# Altium schematic sheet ESP32.SchDoc
size A; SheetNumber: 2; SheetTotal: 6
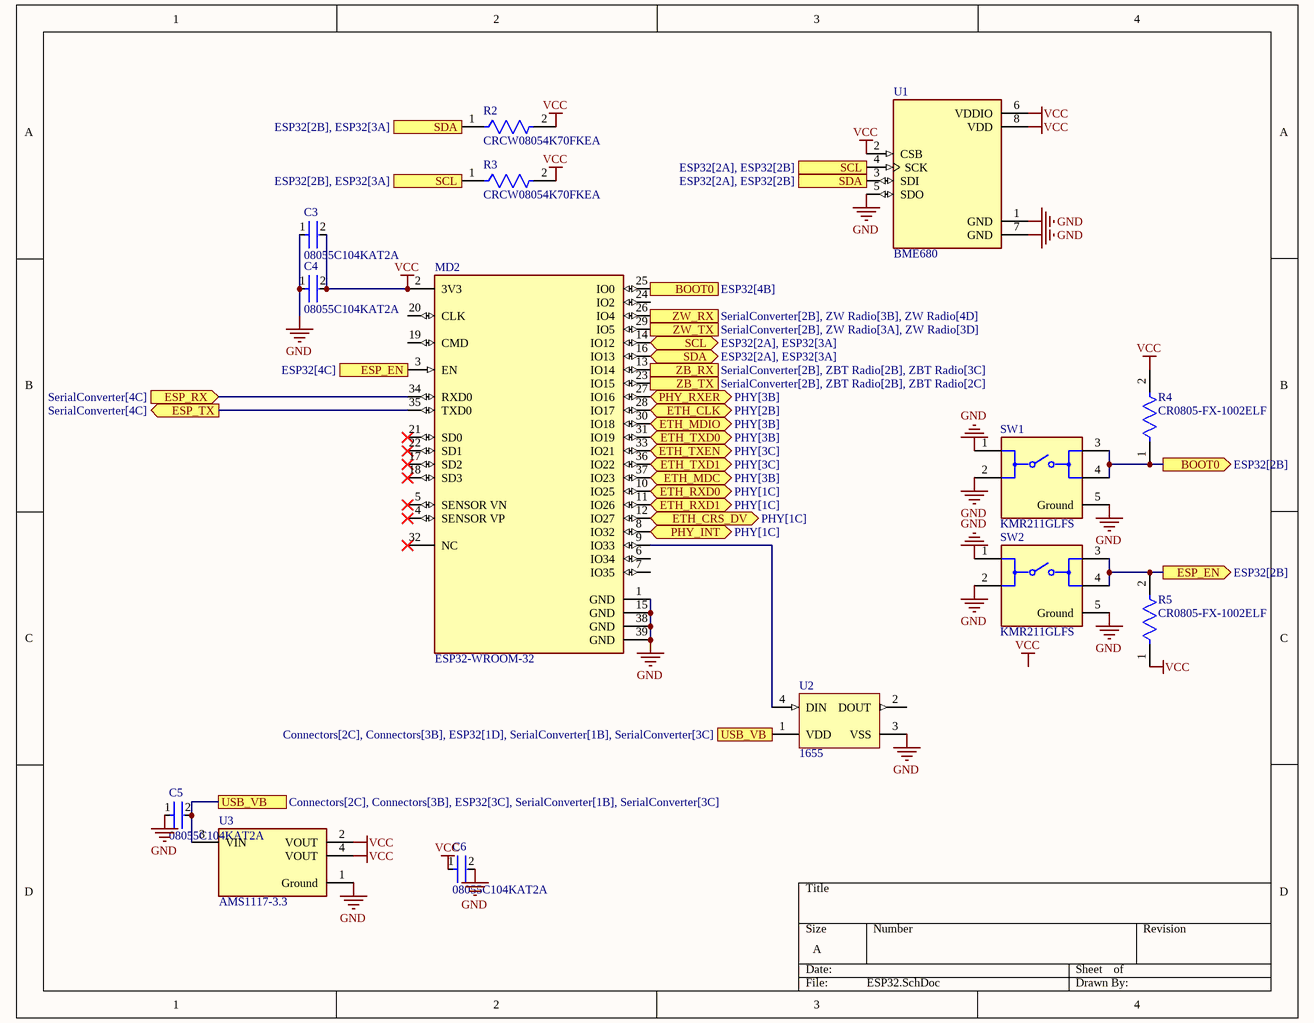
[diagram p0: ESP32.SchDoc]

## Parts
C3  08055C104KAT2A  [FP-0805-L_2_01_0_2-W_1_25-IPC_C]
C4  08055C104KAT2A  [FP-0805-L_2_01_0_2-W_1_25-IPC_C]
C5  08055C104KAT2A  [FP-0805-L_2_01_0_2-W_1_25-IPC_C]
C6  08055C104KAT2A  [FP-0805-L_2_01_0_2-W_1_25-IPC_C]
MD2  ESP32-WROOM-32  [FP-ESP32-WROOM-32-MFG]
R2  CRCW08054K70FKEA  [FP-CRCW0805-e3-IPC_B]
R3  CRCW08054K70FKEA  [FP-CRCW0805-e3-IPC_B]
R4  CR0805-FX-1002ELF  [FP-CR0805-IPC_A]
R5  CR0805-FX-1002ELF  [FP-CR0805-IPC_A]
SW1  KMR211GLFS  [FP-KMR211GLFS-MFG]
SW2  KMR211GLFS  [FP-KMR211GLFS-MFG]
U1  BME680  [PSON80P300X300X100-8N]
U2  1655  [ADA-RGB-1655_V]
U3  AMS1117-3.3  [FP-AMS1117-IPC_C]

## Ports
BOOT0 (in, see ESP32[4B]), BOOT0 (out, see ESP32[2B]), ESP_EN (in, see ESP32[4C]), ESP_EN (out, see ESP32[2B]), ESP_RX (in, see SerialConverter[4C]), ESP_TX (out, see SerialConverter[4C]), ETH_CLK (bidir, see PHY[2B]), ETH_CRS_DV (bidir, see PHY[1C]), ETH_MDC (bidir, see PHY[3B]), ETH_MDIO (bidir, see PHY[3B]), ETH_RXD0 (bidir, see PHY[1C]), ETH_RXD1 (bidir, see PHY[1C]), ETH_TXD0 (bidir, see PHY[3B]), ETH_TXD1 (bidir, see PHY[3C]), ETH_TXEN (bidir, see PHY[3C]), PHY_INT (bidir, see PHY[1C]), PHY_RXER (bidir, see PHY[3B]), SCL (bidir, see ESP32[2A], ESP32[3A]), SCL (see ESP32[2A], ESP32[2B]), SCL (see ESP32[2B], ESP32[3A]), SDA (bidir, see ESP32[2A], ESP32[3A]), SDA (see ESP32[2A], ESP32[2B]), SDA (see ESP32[2B], ESP32[3A]), USB_VB (see Connectors[2C], Connectors[3B], ESP32[1D], SerialConverter[1B], SerialConverter[3C]), USB_VB (see Connectors[2C], Connectors[3B], ESP32[3C], SerialConverter[1B], SerialConverter[3C]), ZB_RX (out, see SerialConverter[2B], ZBT Radio[2B], ZBT Radio[3C]), ZB_TX (in, see SerialConverter[2B], ZBT Radio[2B], ZBT Radio[2C]), ZW_RX (out, see SerialConverter[2B], ZW Radio[3B], ZW Radio[4D]), ZW_TX (in, see SerialConverter[2B], ZW Radio[3A], ZW Radio[3D])

## Nets
GND: C3.1 C4.1 C5.1 C6.2 MD2.1(GND) MD2.15(GND) MD2.38(GND) MD2.39(GND) SW1.1 SW1.2 SW1.5(Ground) SW2.1 SW2.2 SW2.5(Ground) U1.1(GND) U1.5(SDO) U1.7(GND) U2.3(VSS) U3.1(Ground)
VCC: C3.2 C4.2 C6.1 MD2.2(3V3) R2.2 R3.2 R4.2 R5.1 U1.2(CSB) U1.6(VDDIO) U1.8(VDD) U3.2(VOUT) U3.4(VOUT)
BOOT0: MD2.25(IO0) R4.1 SW1.3 SW1.4 ; port BOOT0
ESP_EN: MD2.3(EN) R5.2 SW2.3 SW2.4 ; port ESP_EN
ESP_RX: MD2.34(RXD0) ; port ESP_RX
ESP_TX: MD2.35(TXD0) ; port ESP_TX
ETH_CLK: MD2.28(IO17) ; port ETH_CLK
ETH_CRS_DV: MD2.12(IO27) ; port ETH_CRS_DV
ETH_MDC: MD2.37(IO23) ; port ETH_MDC
ETH_MDIO: MD2.30(IO18) ; port ETH_MDIO
ETH_RXD0: MD2.10(IO25) ; port ETH_RXD0
ETH_RXD1: MD2.11(IO26) ; port ETH_RXD1
ETH_TXD0: MD2.31(IO19) ; port ETH_TXD0
ETH_TXD1: MD2.36(IO22) ; port ETH_TXD1
ETH_TXEN: MD2.33(IO21) ; port ETH_TXEN
PHY_INT: MD2.8(IO32) ; port PHY_INT
PHY_RXER: MD2.27(IO16) ; port PHY_RXER
SCL: MD2.14(IO12) R3.1 U1.4(SCK) ; port SCL
SDA: MD2.16(IO13) R2.1 U1.3(SDI) ; port SDA
USB_VB: C5.2 U2.1(VDD) U3.3(VIN) ; port USB_VB
ZB_RX: MD2.13(IO14) ; port ZB_RX
ZB_TX: MD2.23(IO15) ; port ZB_TX
ZW_RX: MD2.26(IO4) ; port ZW_RX
ZW_TX: MD2.29(IO5) ; port ZW_TX
NetMD2_9: MD2.9(IO33) U2.4(DIN)

Not connected (* = marked no-connect by the designer): MD2 4(SENSOR_VP)* 5(SENSOR_VN)* 6(IO34) 7(IO35) 17(SD2)* 18(SD3)* 19(CMD) 20(CLK) 21(SD0)* 22(SD1)* 24(IO2) 32(NC)*; U2 2(DOUT)

## Notes on the sheet
- Labels drawn without touching a wire or pin: VCC

## Library data of the parts
C3-C6 = CMP-2000-05016-2: General Purpose Ceramic Capacitor, 0805, 100nF, 10%, X7R, 0.15, 50V; Dissipation Factor: 2.5%; Insulation Resistance: 100GR; Voltage Rating (DC): 50V; Package Quantity: 4000; Tolerance: 10%; Voltage Rating: 50V; Dielectric: X7R; Case/Package: 0805; Lead Free: Lead Free; Dielectric Material: Ceramic; Thickness: 0.037inch; Weight: 0.001411oz; Max Operating Temperature: 125°C; REACH SVHC: No SVHC; Mount: Surface Mount; RoHS Compliant: Yes; Depth: 1.25mm; Height: 0.5mm; Case Code (Metric): 2012; Length: 2mm; Termination: Standard; Case Code (Imperial): 0805; Number of Pins: 2; Voltage: 50V; Radiation Hardening: No; Min Operating Temperature: -55°C; Capacitance: 100nF; Width: 1.2mm; Series: MLCC X7R; Packaging: Cut Tape
MD2 = CMP-194065-000008-1: RX TXRX MOD WIFI SURFACE MOUNT; Frequency: 2.5GHz; Sensitivity: -98dBm; Operating Supply Voltage: 3.6V; Data Rate: 150Mbps; Weight: 0.088185oz; Package Quantity: 550; Min Operating Temperature: -40°C; Mount: Surface Mount; Max Operating Temperature: 85°C; Packaging: Cut Tape; Case/Package: SMD/SMT
R2 R3 = CMP-2100-03615-2: RES Thick Film, 4.7kΩ, 1%, 0.125W, 100ppm/°C, 0805; Max Power Dissipation: 125mW; Resistance: 4.7kR; Voltage Rating: 150V; Termination: SMD/SMT; Weight: 0.000194oz; Case/Package: 0805; Number of Terminations: 2; Min Operating Temperature: -55°C; Case Code (Metric): 2012; Package Quantity: 10; Depth: 1.25mm; Military Standard: Not; Composition: Thick Film; Radiation Hardening: No; Contact Plating: Tin; Height: 0.45mm; Power Rating: 125mW; Features: Automotive AEC-Q200; Tolerance: 1%; Packaging: Tape and Reel; Max Operating Temperature: 155°C; Length: 2mm; Case Code (Imperial): 0805; Voltage Rating (DC): 150V; Width: 1.25mm; Temperature Coefficient: 100ppm/°C; Lead Free: Lead Free
R4 R5 = CMP-07231-003204-1: Thick Film Chip Resistors 0805 10kΩ 0.125W 1% 100ppm/°C; Max Power Dissipation: 125mW; Voltage Rating: 150V; Voltage Rating (DC): 100V; Resistance: 10kR; Height: 0.5mm; Tolerance: 1%; Max Operating Temperature: 155°C; Thickness: 508um; Radiation Hardening: No; Packaging: Tape and Reel; Depth: 1.25mm; Contact Plating: Tin; Package Quantity: 1; Case Code (Metric): 2012; REACH SVHC: No SVHC; Min Operating Temperature: -55°C; Power Rating: 125mW; Mount: Surface Mount; Length: 2mm; Case Code (Imperial): 0805; Width: 1.25mm; Temperature Coefficient: 100ppm/°C; Termination: SMD/SMT; Composition: Thick Film; Features: Moisture Resistant; Case/Package: 0805; Number of Terminations: 2
SW1 SW2 = CMP-10040-000023-1: SWITCH TACTILE SPST-NO 0.05A 32V; Switch Function: Off-Mom; Throw Configuration: SPST; Switch Travel: 0.2mm; Current Rating: 50mA; Illumination Type: Non-Illuminated; Actuator Length: 0.5mm; Power Rating: 1W; Operating Force: 1.2N; Actuator Type: Standard; Mechanical Life: 200000Cycles; REACH SVHC: No SVHC; Voltage Rating (DC): 32V; Length: 2.8mm; Min Operating Temperature: -40°C; Mount: Surface Mount; Max Voltage Rating (DC): 32V; Width: 2.8mm; Depth: 4.6mm; Packaging: Tape and Reel; Lead Free: Lead Free; Contact Material: Silver; Termination: Gull Wing; Package Quantity: 1; Contact Current Rating: 50mA; Orientation: Straight; Max Operating Temperature: 85°C; Radiation Hardening: No; Max Current Rating: 50mA; Contact Plating: Silver
U1 = BME680: Integrated Environmental Unit; MF: {'manufacturer': u'Bosch Sensortec'}; Package: None; Price: None; Value: *; MP: BME680; Availability: Unavailable
U2 = CMP-2000-05026-1: Intelligent Control LED Integrated Light Source, 3.5 to 5.3 V, -25 to 80 degC, 4-Pin SMD, RoHS, Tape and Reel; Manufacturer: Adafruit-Industries-LLC; Number of LEDs: 10; Configuration: Discrete; Utilized LED: WS2812(5050); Datasheet URL: http://datasheet.octopart.com/ADA1655-Adafruit-Industries-datasheet-32028139.pdf; Series: Neopixel; Interface: -; Package Description: 4-Pin Surface Mount Device, Body 5 x 5 mm; Color: Red,Green,Blue(RGB); Category: Optoelectronics; Controller Type: -; Package Reference: 1655; Manufacturer URL: https://www.adafruit.com/; Mounting Type: SurfaceMount; Datasheet Version: May-13; Size / Dimension: 5.00mmLx5.00mmW; Family: Addressable,Specialty
U3 = CMP-209535-000001-1: LDO Voltage Regulators 1A, 3.3V; Manufacturer: Advanced Monolithic Systems; Dropout Voltage: 1.1V; Output Type: Fixed; Nominal Supply Current: 5mA; Max Power Dissipation: 1.2W; Max Supply Voltage: 15V; Number Of Outputs: 1; Standoff Height: 0.64mm; Max Junction Temp: +125°C; Height: 1.8mm; Package: AMS1117; Device Class L2: Power Management ICs; ComponentLink2Description: Datasheet; ComponentLink2URL: http://www.advanced-monolithic.com/pdf/ds1117.pdf; Category: IC; RoHS: TRUE; Automotive: No; Device Class L1: Integrated Circuits (ICs); Output Current: 1A; Device Class L3: Voltage Regulators - Linear; Temperature: -40°C to +125°C; Output Voltage: 3.3V; Manufacturer Part Number: AMS1117-3.3; Temperature Range Low: -40°C; Octopart: https://octopart.com/ams1117-3.3-advanced+monolithic+systems-25899300; Lead Free: Yes; Ipc Land Pattern Name: SOT229P700X180-4; Temperature Range High: +125°C